# EAGLE schematic RFfrontend_v4 (EAGLE 7.5.0)

## Sheet 1 of 3
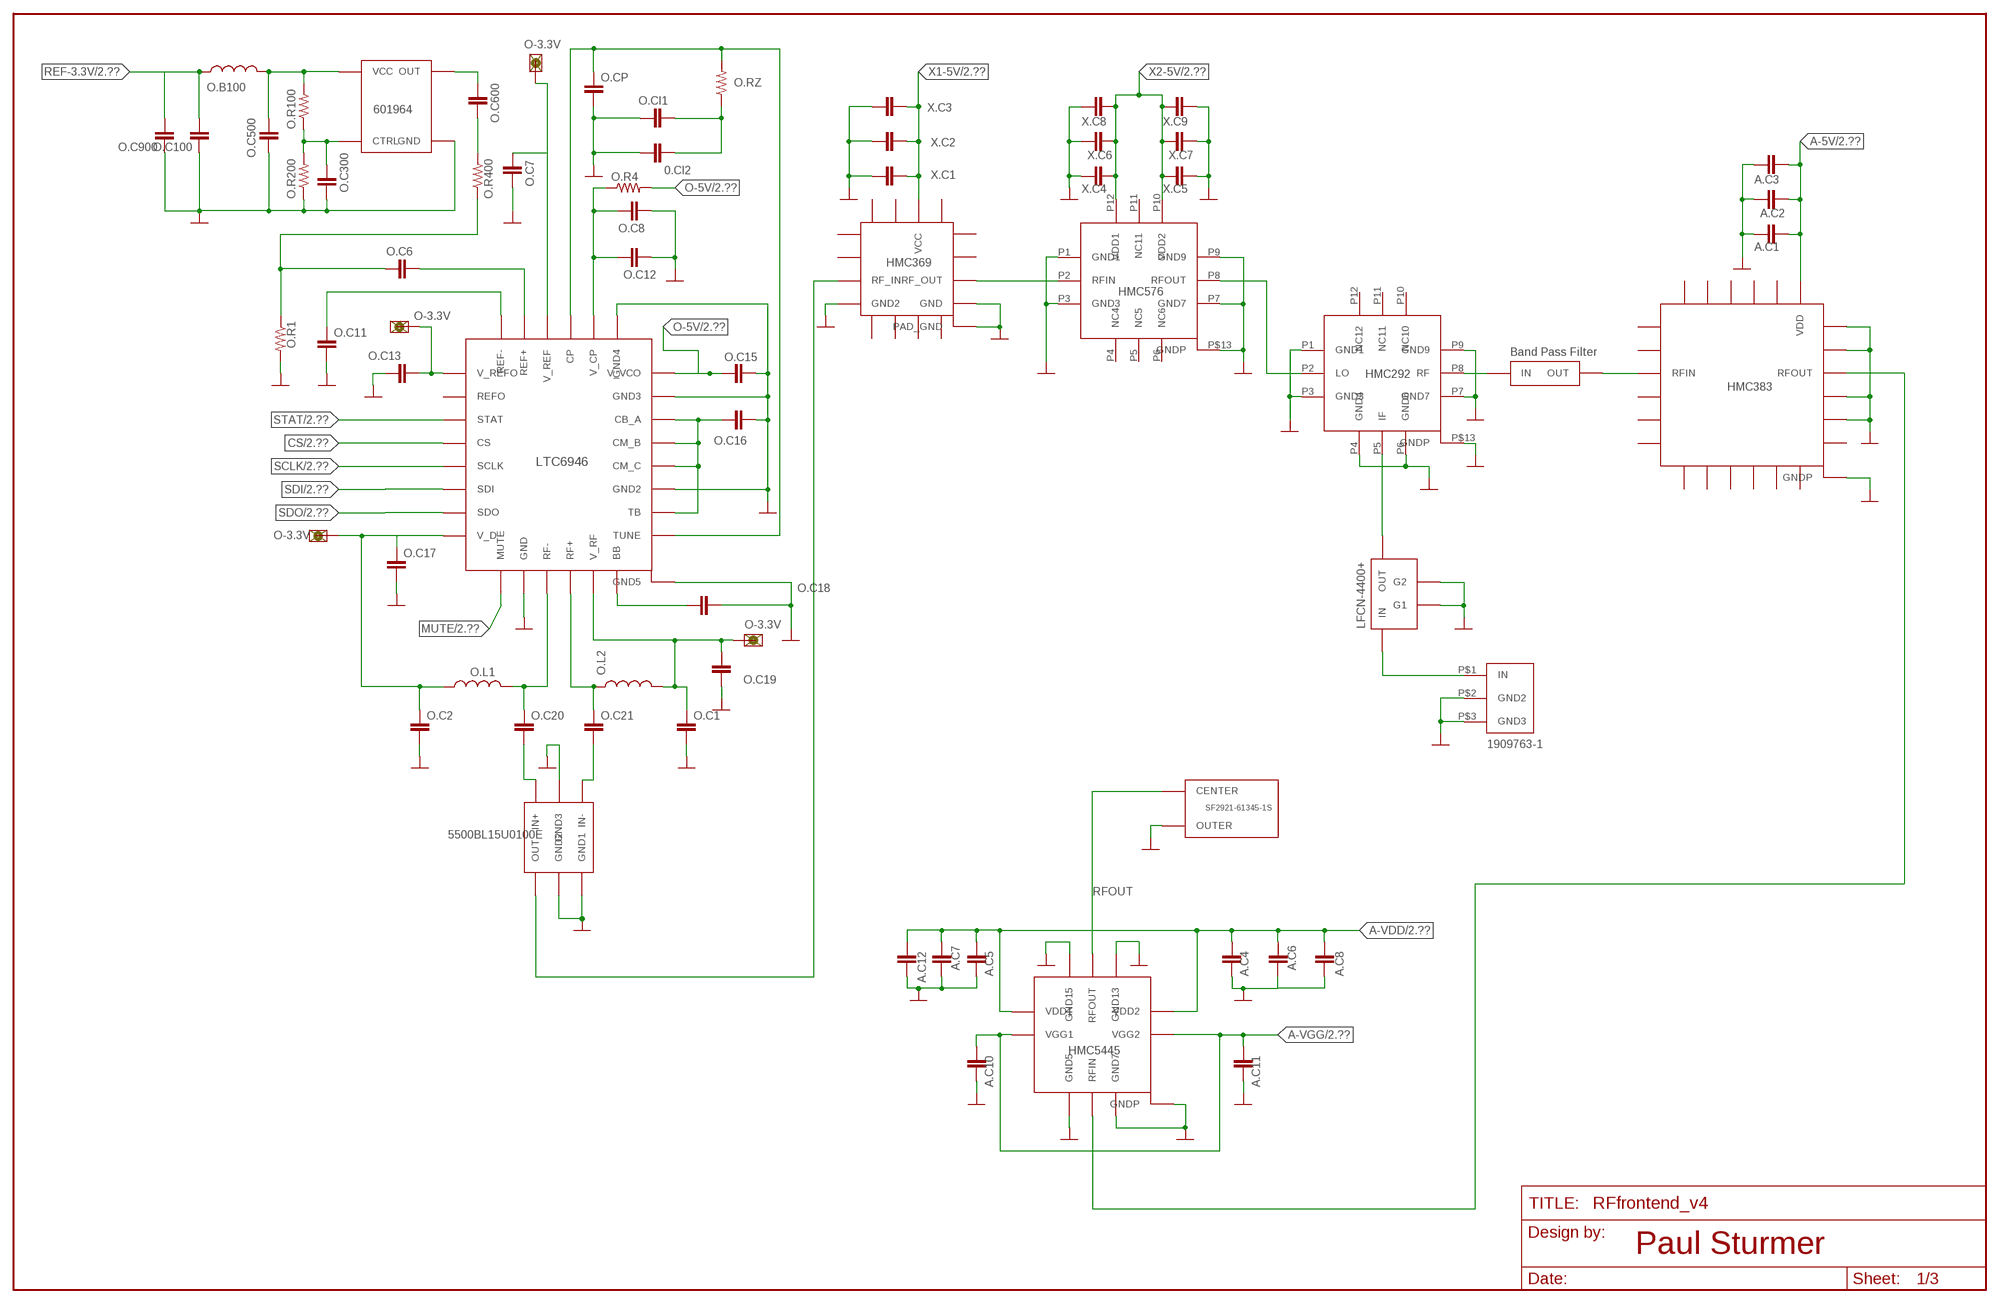
[diagram p0: schematic, sheet 1]

### Parts
0.CI2  CAP0805  [0805]
3.3V  1PIN_B-T-B_TOPPAD  [1PIN_B-T-B_TOPPAD]
A.C1  CAP0402-CAP  [0402-CAP]
A.C2  CAP0603-CAP  [0603-CAP]
A.C3  CAP0805  [0805]
A.C4  CAP0402-CAP  [0402-CAP]
A.C5  CAP0402-CAP  [0402-CAP]
A.C6  CAP0603-CAP  [0603-CAP]
A.C7  CAP0603-CAP  [0603-CAP]
A.C8  CAP0805  [0805]
A.C10  CAP0402-CAP  [0402-CAP]
A.C11  CAP0402-CAP  [0402-CAP]
A.C12  CAP0805  [0805]
O-3.3V  1PIN_B-T-B_TOPPAD  [1PIN_B-T-B_TOPPAD]
O.B100  INDUCTOR0603  [0603]
O.C1  CAP0402-CAP  [0402-CAP]
O.C2  CAP0402-CAP  [0402-CAP]
O.C6  CAP0402-CAP  [0402-CAP]
O.C7  CAP0402-CAP  [0402-CAP]
O.C8  CAP0805  [0805]
O.C11  CAP0402-CAP  [0402-CAP]
O.C12  CAP0402-CAP  [0402-CAP]
O.C13  CAP0402-CAP  [0402-CAP]
O.C15  CAP0402-CAP  [0402-CAP]
O.C16  CAP0805  [0805]
O.C17  CAP0402-CAP  [0402-CAP]
O.C18  CAP0805  [0805]
O.C19  CAP0402-CAP  [0402-CAP]
O.C20  CAP0402-CAP  [0402-CAP]
O.C21  CAP0402-CAP  [0402-CAP]
O.C100  CAP1206  [1206]
O.C300  CAP0603-CAP  [0603-CAP]
O.C500  CAP0603-CAP  [0603-CAP]
O.C600  CAP0603-CAP  [0603-CAP]
O.C900  CAP1206  [1206]
O.CI1  CAP0603-CAP  [0603-CAP]
O.CP  CAP0603-CAP  [0603-CAP]
O.L1  INDUCTOR0402  [C0402]
O.L2  INDUCTOR0402  [C0402]
O.R1  RESISTOR0402-RES  [0402-RES]
O.R4  RESISTOR0402-RES  [0402-RES]
O.R100  RESISTOR0603  [0603-RES]
O.R200  RESISTOR0603  [0603-RES]
O.R400  RESISTOR0603  [0603-RES]
O.RZ  RESISTOR0603  [0603-RES]
U$1  LINEAR_LTC6946  [QFN_28PIN]
U$9  1PIN_B-T-B_TOPPAD  [1PIN_B-T-B_TOPPAD]
U$13  CRYSTEK_601964  [4_PIN_9X14MM]
U$14  HITTITE_HMC369  [LP3]
U$15  MINICIRCUITS_LPF  [FV1206]
U$18  1PIN_B-T-B_TOPPAD  [1PIN_B-T-B_TOPPAD]
U$22  HITTITE_HMC576  [12PIN_QFN]
U$29  HITTITE_HMC292  [12PIN_QFN]
U$39  JOHNSON_5500BL15U0100  [6_PIN_BALUN]
U$41  BPF_24GHZ  [BPF_24GHZ]
U$43  HITTITE_HMC383  [24-QFN]
U$44  HITTITE_HMC5445  [16PIN_SMT]
U$75  SMA_STRAIGHT_SF2921-61345-1S  [SMA_STRAIGHT_SF2921-61345-1S]
U$169  TE_UMCC_CONNECTOR  [3_PIN_UMCC]
X.C1  CAP0402-CAP  [0402-CAP]
X.C2  CAP0603-CAP  [0603-CAP]
X.C3  CAP0805  [0805]
X.C4  CAP0402-CAP  [0402-CAP]
X.C5  CAP0402-CAP  [0402-CAP]
X.C6  CAP0603-CAP  [0603-CAP]
X.C7  CAP0603-CAP  [0603-CAP]
X.C8  CAP0805  [0805]
X.C9  CAP0805  [0805]

### Nets
12GHZ: U$14.PIN10(RF_OUT) U$22.P2(RFIN)
A-5V: A.C1.2 A.C2.2 A.C3.2 U$43.P$19(VDD) ; also sheet 2
A-VDD: A.C4.2 A.C5.2 A.C6.2 A.C7.2 A.C8.2 A.C12.2 U$44.P1(VDD1) U$44.P11(VDD2) ; also sheet 2
A-VGG: A.C10.2 A.C11.2 U$44.P2(VGG1) U$44.P10(VGG2) ; also sheet 2
AGND: 0.CI2.1 A.C1.1 A.C2.1 A.C3.1 A.C4.1 A.C5.1 A.C6.1 A.C7.1 A.C8.1 A.C10.1 A.C11.1 A.C12.1 O.C1.2 O.C2.2 O.C7.1 O.C8.2 O.C11.2 O.C12.2 O.C13.1 O.C15.2 O.C16.2 O.C17.2 O.C18.2 O.C19.1 O.C100.1 O.C300.2 O.C500.2 O.C900.1 O.CI1.1 O.CP.2 O.R1.2 O.R200.1 U$1.P$10(GND) U$1.P$17(GND2) U$1.P$21(GND3) U$1.P$23(GND4) U$1.P$29(GND5) U$13.GND U$14.PAD_GND U$14.PIN4(GND2) U$14.PIN9(GND) U$15.P$1(G1) U$15.P$2(G2) U$22.P1(GND1) U$22.P3(GND3) U$22.P7(GND7) U$22.P9(GND9) U$22.P$13(GNDP) U$29.P1(GND1) U$29.P3(GND3) U$29.P4(GND4) U$29.P6(GND6) U$29.P7(GND7) U$29.P9(GND9) U$29.P$13(GNDP) U$39.P$2(GND2) U$39.P$3(GND1) U$39.P$5(GND3) U$43.P$14(NC14) U$43.P$15(NC15) U$43.P$17(NC17) U$43.P$18(NC18) U$43.P$25(GNDP) U$44.GNDP U$44.P5(GND5) U$44.P7(GND7) U$44.P13(GND13) U$44.P15(GND15) U$75.OUTER U$169.P$2(GND2) U$169.P$3(GND3) X.C1.1 X.C2.1 X.C3.1 X.C4.1 X.C5.2 X.C6.1 X.C7.2 X.C8.1 X.C9.2 ; also sheet 2
CS: U$1.P$4(CS) ; also sheet 2
MUTE: U$1.P$9(MUTE) ; also sheet 2
N$1: O.C8.1 O.C12.1 O.R4.1 U$1.P$24(V_CP)
N$2: O.C16.1 U$1.P$16(TB) U$1.P$18(CM_C) U$1.P$19(CM_B) U$1.P$20(CB_A)
N$3: O.C20.2 U$39.P$6(IN+)
N$4: 0.CI2.2 O.CI1.2 O.RZ.1
N$5: O.CP.1 O.RZ.2 U$1.P$15(TUNE) U$1.P$25(CP)
N$6: O.C18.1 U$1.P$14(BB)
N$7: O.C20.1 O.L1.2 U$1.P$11(RF-)
N$8: O.C21.1 O.L2.1 U$1.P$12(RF+)
N$9: O.C21.2 U$39.P$4(IN-)
N$10: U$14.PIN3(RF_IN) U$39.P$1(OUT)
N$11: O.C11.1 U$1.P$28(REF-)
N$12: O.C6.2 U$1.P$27(REF+)
N$13: O.C6.1 O.R1.1 O.R400.1
N$14: O.B100.2 O.C500.1 O.R100.2 U$13.VCC
N$15: O.C300.1 O.R100.1 O.R200.2 U$13.VCTRL(CTRL)
N$16: O.C600.1 U$13.OUT
N$17: U$22.P8(RFOUT) U$29.P2(LO)
N$18: O.C600.2 O.R400.2
N$20: U$15.P$4(OUT) U$29.P5(IF)
N$26: U$29.P8(RF) U$41.IN
N$27: U$41.OUT U$43.P$3(RFIN)
N$28: U$43.P$16(RFOUT) U$44.P6(RFIN)
N$32: U$15.P$3(IN) U$169.P$1(IN)
O-3.3V: 3.3V.P$1 O-3.3V.P$1 O.C1.1 O.C2.1 O.C7.2 O.C13.2 O.C17.1 O.C19.2 O.L1.1 O.L2.2 U$1.P$1(V_REFO) U$1.P$8(V_D) U$1.P$13(V_RF) U$1.P$26(V_REF) U$9.P$1 U$18.P$1 ; also sheet 2
O-5V: O.C15.1 O.R4.2 U$1.P$22(V_VCO) ; also sheet 2
REF-3.3V: O.B100.1 O.C100.2 O.C900.2 ; also sheet 2
RFOUT: U$44.P14(RFOUT) U$75.CENTER
SCLK: U$1.P$5(SCLK) ; also sheet 2
SDI: U$1.P$6(SDI) ; also sheet 2
SDO: U$1.P$7(SDO) ; also sheet 2
STAT: U$1.P$3(STAT) ; also sheet 2
X1-5V: U$14.PIN14(VCC) X.C1.2 X.C2.2 X.C3.2 ; also sheet 2
X2-5V: U$22.P10(VDD2) U$22.P12(VDD1) X.C4.2 X.C5.1 X.C6.2 X.C7.1 X.C8.2 X.C9.1 ; also sheet 2
Unconnected: U$1.P$2(REFO) U$14.PIN1 U$14.PIN2 U$14.PIN5 U$14.PIN6 U$14.PIN7 U$14.PIN8 U$14.PIN11 U$14.PIN12 U$14.PIN13 U$14.PIN15 U$14.PIN16 U$22.P4(NC4) U$22.P5(NC5) U$22.P6(NC6) U$22.P11(NC11) U$29.P10(NC10) U$29.P11(NC11) U$29.P12(NC12) U$43.P$1(NC1) U$43.P$2(NC2) U$43.P$4(NC4) U$43.P$5(NC5) U$43.P$6(NC6) U$43.P$7(NC7) U$43.P$8(NC8) U$43.P$9(NC9) U$43.P$10(NC10) U$43.P$11(NC11) U$43.P$12(NC12) U$43.P$13(NC13) U$43.P$20(NC20) U$43.P$21(NC21) U$43.P$22(NC22) U$43.P$23(NC23) U$43.P$24(NC24)

## Sheet 2 of 3
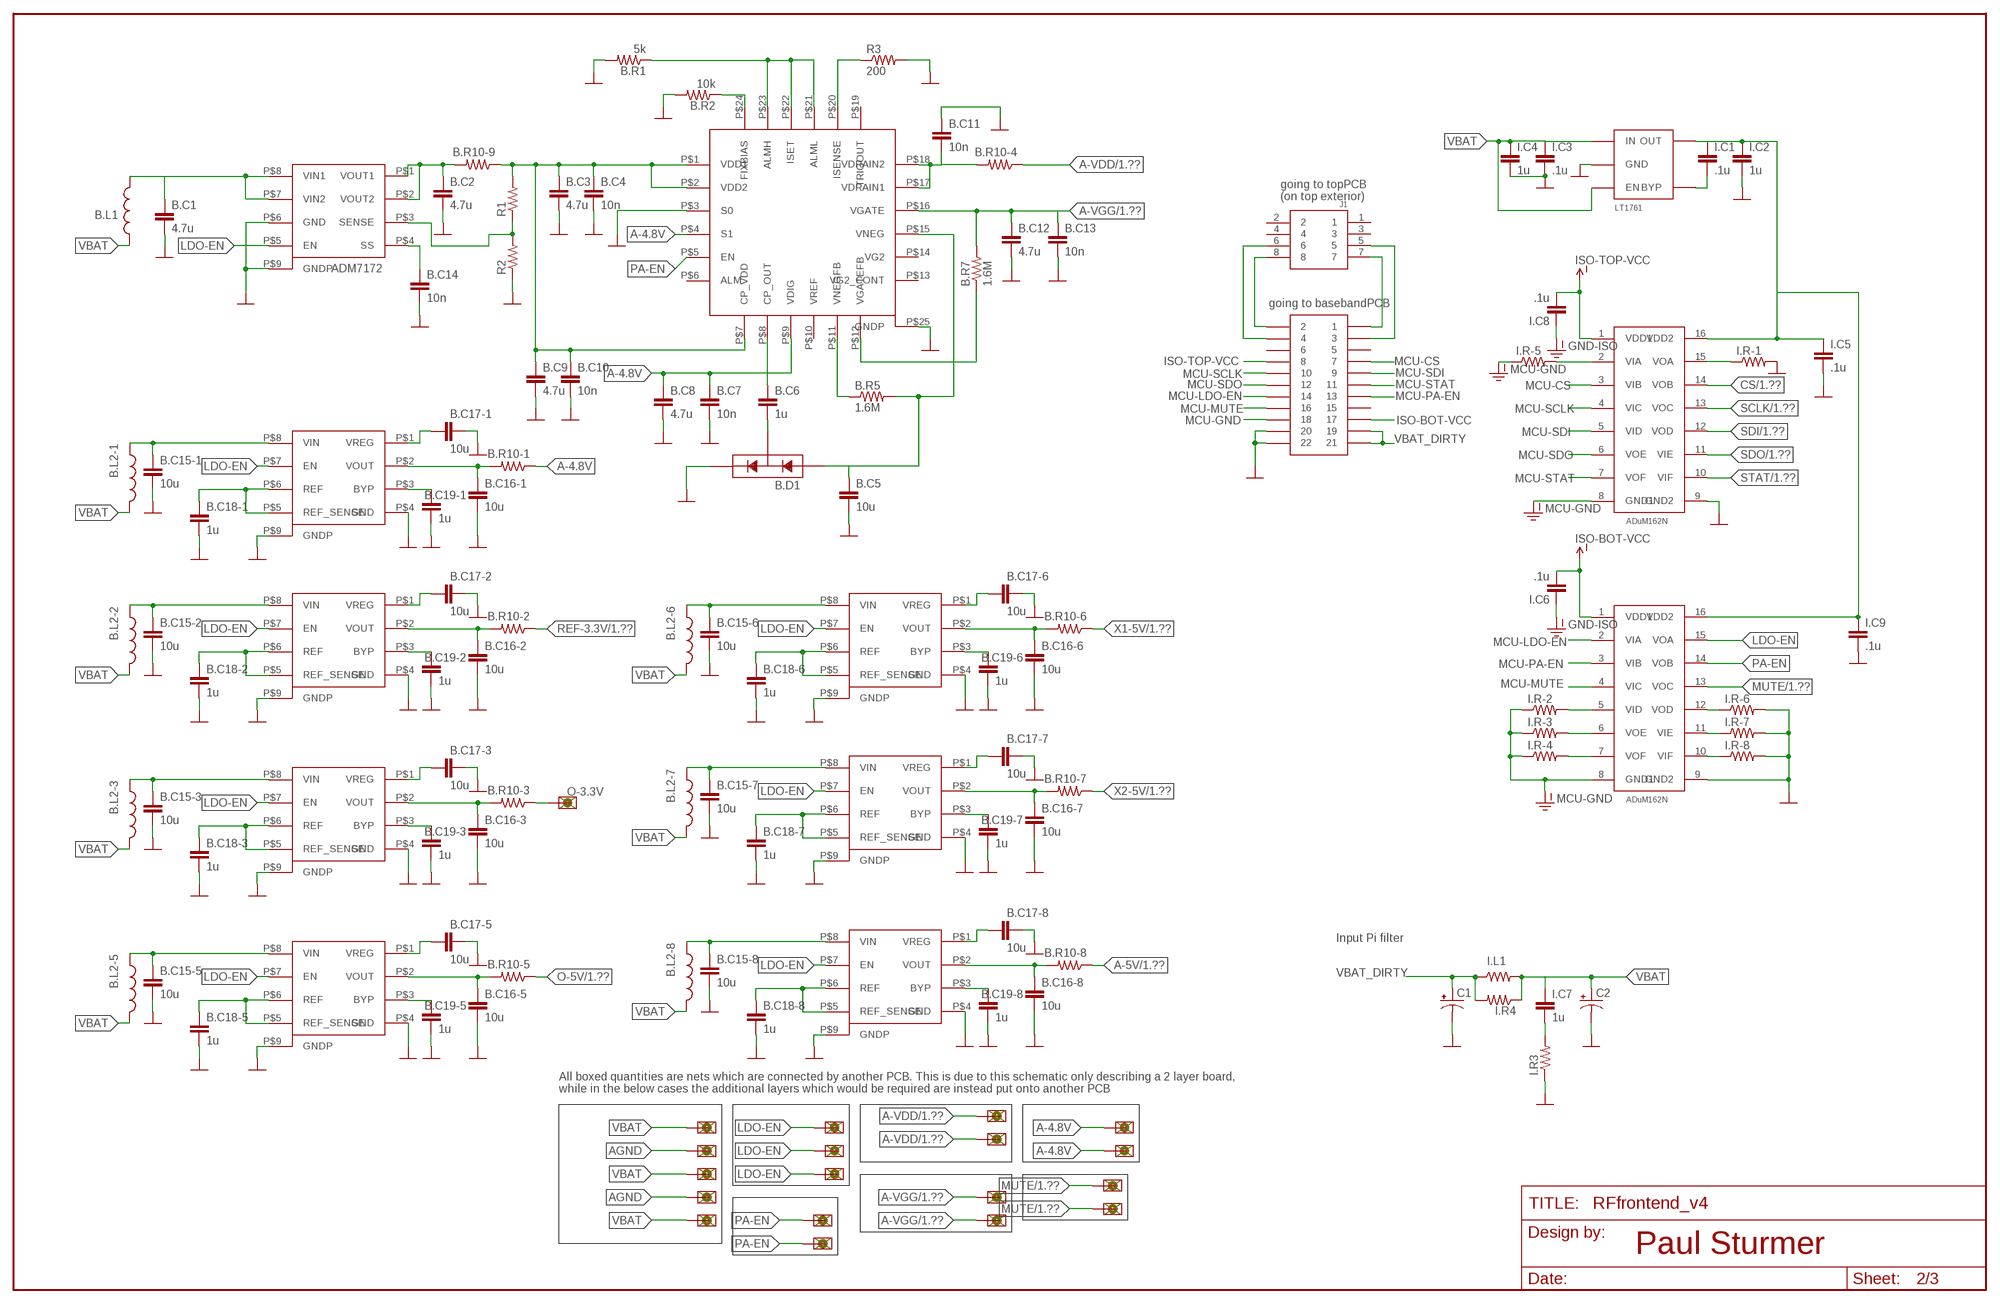
[diagram p1: schematic, sheet 2]

### Parts
B.C1  4.7u  CAP1206  [1206]
B.C2  4.7u  CAP1206  [1206]
B.C3  4.7u  CAP0603-CAP  [0603-CAP]
B.C4  10n  CAP0603-CAP  [0603-CAP]
B.C5  10u  CAP0805  [0805]
B.C6  1u  CAP0805  [0805]
B.C7  10n  CAP0603-CAP  [0603-CAP]
B.C8  4.7u  CAP0603-CAP  [0603-CAP]
B.C9  4.7u  CAP0603-CAP  [0603-CAP]
B.C10  10n  CAP0603-CAP  [0603-CAP]
B.C11  10n  CAP0603-CAP  [0603-CAP]
B.C12  4.7u  CAP0603-CAP  [0603-CAP]
B.C13  10n  CAP0603-CAP  [0603-CAP]
B.C14  10n  CAP0603-CAP  [0603-CAP]
B.C15-1  10u  CAP0805  [0805]
B.C15-2  10u  CAP0805  [0805]
B.C15-3  10u  CAP0805  [0805]
B.C15-5  10u  CAP0805  [0805]
B.C15-6  10u  CAP0805  [0805]
B.C15-7  10u  CAP0805  [0805]
B.C15-8  10u  CAP0805  [0805]
B.C16-1  10u  CAP0805  [0805]
B.C16-2  10u  CAP0805  [0805]
B.C16-3  10u  CAP0805  [0805]
B.C16-5  10u  CAP0805  [0805]
B.C16-6  10u  CAP0805  [0805]
B.C16-7  10u  CAP0805  [0805]
B.C16-8  10u  CAP0805  [0805]
B.C17-1  10u  CAP0805  [0805]
B.C17-2  10u  CAP0805  [0805]
B.C17-3  10u  CAP0805  [0805]
B.C17-5  10u  CAP0805  [0805]
B.C17-6  10u  CAP0805  [0805]
B.C17-7  10u  CAP0805  [0805]
B.C17-8  10u  CAP0805  [0805]
B.C18-1  1u  CAP0805  [0805]
B.C18-2  1u  CAP0805  [0805]
B.C18-3  1u  CAP0805  [0805]
B.C18-5  1u  CAP0805  [0805]
B.C18-6  1u  CAP0805  [0805]
B.C18-7  1u  CAP0805  [0805]
B.C18-8  1u  CAP0805  [0805]
B.C19-1  1u  CAP0805  [0805]
B.C19-2  1u  CAP0805  [0805]
B.C19-3  1u  CAP0805  [0805]
B.C19-5  1u  CAP0805  [0805]
B.C19-6  1u  CAP0805  [0805]
B.C19-7  1u  CAP0805  [0805]
B.C19-8  1u  CAP0805  [0805]
B.D1  ONSEMI_DIODE_BAT54SL  [SOT23-3]
B.L1  INDUCTOR0805  [0805]
B.L2-1  INDUCTOR0603  [0603]
B.L2-2  INDUCTOR0603  [0603]
B.L2-3  INDUCTOR0603  [0603]
B.L2-5  INDUCTOR0603  [0603]
B.L2-6  INDUCTOR0603  [0603]
B.L2-7  INDUCTOR0603  [0603]
B.L2-8  INDUCTOR0603  [0603]
B.R1  5k  RESISTOR0603  [0603-RES]
B.R2  10k  RESISTOR0805-RES  [0805]
B.R5  1.6M  RESISTOR0805-RES  [0805]
B.R7  1.6M  RESISTOR0805-RES  [0805]
B.R10-1  RESISTOR0805-RES  [0805]
B.R10-2  RESISTOR0805-RES  [0805]
B.R10-3  RESISTOR0805-RES  [0805]
B.R10-4  RESISTOR0805-RES  [0805]
B.R10-5  RESISTOR0805-RES  [0805]
B.R10-6  RESISTOR0805-RES  [0805]
B.R10-7  RESISTOR0805-RES  [0805]
B.R10-8  RESISTOR0805-RES  [0805]
B.R10-9  RESISTOR0805-RES  [0805]
C1  CAP_POL7343  [EIA7343]
C2  CAP_POL7343  [EIA7343]
I.C1  .1u  CAP0402-CAP  [0402-CAP]
I.C2  1u  CAP0805  [0805]
I.C3  .1u  CAP0402-CAP  [0402-CAP]
I.C4  1u  CAP0805  [0805]
I.C5  .1u  CAP0402-CAP  [0402-CAP]
I.C6  .1u  CAP0402-CAP  [0402-CAP]
I.C7  1u  CAP0805  [0805]
I.C8  .1u  CAP0402-CAP  [0402-CAP]
I.C9  .1u  CAP0402-CAP  [0402-CAP]
I.L1  RESISTOR1206  [1206]
I.R3  RESISTOR0805-RES  [0805]
I.R4  RESISTOR0805-RES  [0805]
I.R-1  RESISTOR0402-RES  [0402-RES]
I.R-2  RESISTOR0402-RES  [0402-RES]
I.R-3  RESISTOR0402-RES  [0402-RES]
I.R-4  RESISTOR0402-RES  [0402-RES]
I.R-5  RESISTOR0402-RES  [0402-RES]
I.R-6  RESISTOR0402-RES  [0402-RES]
I.R-7  RESISTOR0402-RES  [0402-RES]
I.R-8  RESISTOR0402-RES  [0402-RES]
J1  SLW-104-01-X-D  [SLW-104-01-X-D]
R1  RESISTOR0805-RES  [0805]
R2  RESISTOR0805-RES  [0805]
R3  200  RESISTOR0805-RES  [0805]
U$19  1PIN_B-T-B_TOPPAD  [1PIN_B-T-B_TOPPAD]
U$20  1PIN_B-T-B_TOPPAD  [1PIN_B-T-B_TOPPAD]
U$25  1PIN_B-T-B_TOPPAD  [1PIN_B-T-B_TOPPAD]
U$26  1PIN_B-T-B_TOPPAD  [1PIN_B-T-B_TOPPAD]
U$28  1PIN_B-T-B_TOPPAD  [1PIN_B-T-B_TOPPAD]
U$35  1PIN_B-T-B_TOPPAD  [1PIN_B-T-B_TOPPAD]
U$36  1PIN_B-T-B_TOPPAD  [1PIN_B-T-B_TOPPAD]
U$51  ANALOG_ADUM162N0BRZ  [SO16]
U$61  ANALOG_LDO_ADM7172  [8-LFCSP]
U$62  HITTITE_HMC980LP4E  [24-QFN]
U$84  ANALOG_LDO_ADM7150  [8-LFCSP]
U$95  ANALOG_LDO_ADM7150  [8-LFCSP]
U$103  ANALOG_LDO_ADM7150  [8-LFCSP]
U$111  ANALOG_ADUM162N0BRZ  [SO16]
U$113  LINEAR_LDO_LT1761-X  [SOT-23-5]
U$119  ANALOG_LDO_ADM7150  [8-LFCSP]
U$127  ANALOG_LDO_ADM7150  [8-LFCSP]
U$135  ANALOG_LDO_ADM7150  [8-LFCSP]
U$143  ANALOG_LDO_ADM7150  [8-LFCSP]
U$152  1PIN_B-T-B_GROUND  [1PIN_B-T-B_GROUND]
U$153  1PIN_B-T-B_TOPPAD  [1PIN_B-T-B_TOPPAD]
U$154  1PIN_B-T-B_TOPPAD  [1PIN_B-T-B_TOPPAD]
U$155  1PIN_B-T-B_TOPPAD  [1PIN_B-T-B_TOPPAD]
U$156  1PIN_B-T-B_GROUND  [1PIN_B-T-B_GROUND]
U$157  1PIN_B-T-B_TOPPAD  [1PIN_B-T-B_TOPPAD]
U$174  1PIN_B-T-B_TOPPAD  [1PIN_B-T-B_TOPPAD]
U$175  1PIN_B-T-B_TOPPAD  [1PIN_B-T-B_TOPPAD]
U$176  1PIN_B-T-B_TOPPAD  [1PIN_B-T-B_TOPPAD]
U$177  1PIN_B-T-B_TOPPAD  [1PIN_B-T-B_TOPPAD]
U$180  SSW-111-XX-XXX-D  [SSW-111-XX-XXX-D]
U$189  1PIN_B-T-B_TOPPAD  [1PIN_B-T-B_TOPPAD]
U$190  1PIN_B-T-B_TOPPAD  [1PIN_B-T-B_TOPPAD]

### Nets
6.3V: B.C3.1 B.C4.1 B.C9.1 B.C10.1 B.R10-9.1 R1.2 U$62.P$1(VDD1) U$62.P$2(VDD2) U$62.P$7(CP_VDD)
A-4.8V: B.C7.1 B.C8.1 B.C16-1.1 B.R10-1.1 B.R10-1.2 U$26.P$1 U$28.P$1 U$62.P$4(S1) U$62.P$9(VDIG) U$84.P$2(VOUT)
A-5V: B.R10-8.1 ; also sheet 1
A-VDD: B.C11.2 B.R10-4.1 B.R10-4.2 U$62.P$17(VDRAIN1) U$62.P$18(VDRAIN2) U$174.P$1 U$175.P$1 ; also sheet 1
A-VGG: B.C12.1 B.C13.1 B.R7.2 U$62.P$16(VGATE) U$176.P$1 U$177.P$1 ; also sheet 1
AGND: B.C1.2 B.C2.2 B.C3.2 B.C4.2 B.C5.2 B.C7.2 B.C8.2 B.C9.2 B.C10.2 B.C11.1 B.C12.2 B.C13.2 B.C14.2 B.C15-1.2 B.C15-2.2 B.C15-3.2 B.C15-5.2 B.C15-6.2 B.C15-7.2 B.C15-8.2 B.C16-1.2 B.C16-2.2 B.C16-3.2 B.C16-5.2 B.C16-6.2 B.C16-7.2 B.C16-8.2 B.C17-1.1 B.C17-2.1 B.C17-3.1 B.C17-5.1 B.C17-6.1 B.C17-7.1 B.C17-8.1 B.C18-1.2 B.C18-2.2 B.C18-3.2 B.C18-5.2 B.C18-6.2 B.C18-7.2 B.C18-8.2 B.C19-1.2 B.C19-2.2 B.C19-3.2 B.C19-5.2 B.C19-6.2 B.C19-7.2 B.C19-8.2 B.D1.2 B.R1.2 B.R2.2 C1.C(-) C2.C(-) I.C2.2 I.C3.2 I.C4.2 I.C5.2 I.C9.2 I.R3.1 I.R-1.2 I.R-6.2 I.R-7.2 I.R-8.2 R2.1 R3.2 U$51.9(GND2) U$61.P$6(GND) U$61.P$9(GNDP) U$62.P$3(S0) U$62.P$25(GNDP) U$84.P$4(GND) U$84.P$9(GNDP) U$95.P$4(GND) U$95.P$9(GNDP) U$103.P$4(GND) U$103.P$9(GNDP) U$111.9(GND2) U$113.P$2(GND) U$119.P$4(GND) U$119.P$9(GNDP) U$127.P$4(GND) U$127.P$9(GNDP) U$135.P$4(GND) U$135.P$9(GNDP) U$143.P$4(GND) U$143.P$9(GNDP) U$152.P$2 U$156.P$2 U$180.20 U$180.22 ; also sheet 1
CS: U$111.14(VOB) ; also sheet 1
ISO-3.3V: I.C1.1 I.C2.1 I.C5.1 I.C9.1 U$51.16(VDD2) U$111.16(VDD2) U$113.P$5(OUT)
ISO-BOT-VCC: I.C6.2 U$51.1(VDD1) U$180.17
ISO-TOP-VCC: I.C8.2 U$111.1(VDD1) U$180.8
LDO-EN: U$35.P$1 U$36.P$1 U$51.15(VOA) U$61.P$5(EN) U$84.P$7(EN) U$95.P$7(EN) U$103.P$7(EN) U$119.P$7(EN) U$127.P$7(EN) U$135.P$7(EN) U$143.P$7(EN) U$153.P$1
MCU-CS: U$111.3(VIB) U$180.7
MCU-GND: I.C6.1 I.C8.1 I.R-2.1 I.R-3.1 I.R-4.1 I.R-5.1 U$51.8(GND1) U$111.8(GND1) U$180.18 ; supply symbol labelled GND-ISO
MCU-LDO-EN: U$51.2(VIA) U$180.14
MCU-MUTE: U$51.4(VIC) U$180.16
MCU-PA-EN: U$51.3(VIB) U$180.13
MCU-SCLK: U$111.4(VIC) U$180.10
MCU-SDI: U$111.5(VID) U$180.9
MCU-SDO: U$111.6(VOE) U$180.12
MCU-STAT: U$111.7(VOF) U$180.11
MUTE: U$51.13(VOC) U$189.P$1 U$190.P$1 ; also sheet 1
N$29: R1.1 R2.2 U$61.P$3(SENSE)
N$30: I.R-1.1 U$111.15(VOA)
N$35: R3.1 U$62.P$20(ISENSE)
N$36: B.R7.1 U$62.P$12(VGATEFB)
N$37: B.C5.1 B.D1.1 B.R5.2 U$62.P$15(VNEG)
N$39: B.R5.1 U$62.P$11(VNEGFB)
N$42: B.C6.1 U$62.P$8(CP_OUT)
N$43: B.C6.2 B.D1.3
N$44: B.R1.1 U$62.P$21(ALML) U$62.P$22(ISET) U$62.P$23(ALMH)
N$45: B.R2.1 U$62.P$24(FIXBIAS)
N$46: B.C14.1 U$61.P$4(SS)
N$47: B.C15-1.1 B.L2-1.1 U$84.P$8(VIN)
N$48: B.C17-1.2 U$84.P$1(VREG)
N$49: B.C18-1.1 U$84.P$5(REF_SENSE) U$84.P$6(REF)
N$50: B.C15-2.1 B.L2-2.1 U$95.P$8(VIN)
N$51: J1.7 U$180.1
N$52: B.C19-1.1 U$84.P$3(BYP)
N$53: B.C18-2.1 U$95.P$5(REF_SENSE) U$95.P$6(REF)
N$54: B.C19-2.1 U$95.P$3(BYP)
N$55: B.C16-2.1 B.R10-2.2 U$95.P$2(VOUT)
N$56: B.C15-5.1 B.L2-5.1 U$119.P$8(VIN)
N$57: B.C15-3.1 B.L2-3.1 U$103.P$8(VIN)
N$58: B.C17-3.2 U$103.P$1(VREG)
N$59: B.C18-3.1 U$103.P$5(REF_SENSE) U$103.P$6(REF)
N$60: B.C19-3.1 U$103.P$3(BYP)
N$61: B.C16-3.1 B.R10-3.2 U$103.P$2(VOUT)
N$62: B.C17-5.2 U$119.P$1(VREG)
N$63: I.C1.2 U$113.P$4(BYP)
N$64: J1.5 U$180.3
N$66: B.C17-2.2 U$95.P$1(VREG)
N$69: B.C18-5.1 U$119.P$5(REF_SENSE) U$119.P$6(REF)
N$70: B.C19-5.1 U$119.P$3(BYP)
N$71: B.C16-5.1 B.R10-5.2 U$119.P$2(VOUT)
N$72: B.C15-6.1 B.L2-6.1 U$127.P$8(VIN)
N$73: B.C17-6.2 U$127.P$1(VREG)
N$74: B.C18-6.1 U$127.P$5(REF_SENSE) U$127.P$6(REF)
N$75: I.R-5.2 U$111.2(VIA)
N$76: B.C16-6.1 B.R10-6.2 U$127.P$2(VOUT)
N$77: B.C15-7.1 B.L2-7.1 U$135.P$8(VIN)
N$78: B.C17-7.2 U$135.P$1(VREG)
N$79: B.C18-7.1 U$135.P$5(REF_SENSE) U$135.P$6(REF)
N$80: B.C19-7.1 U$135.P$3(BYP)
N$81: B.C16-7.1 B.R10-7.2 U$135.P$2(VOUT)
N$82: B.C15-8.1 B.L2-8.1 U$143.P$8(VIN)
N$83: B.C17-8.2 U$143.P$1(VREG)
N$84: B.C18-8.1 U$143.P$5(REF_SENSE) U$143.P$6(REF)
N$85: B.C19-8.1 U$143.P$3(BYP)
N$86: B.C16-8.1 B.R10-8.2 U$143.P$2(VOUT)
N$95: B.C2.1 B.R10-9.2 U$61.P$1(VOUT1) U$61.P$2(VOUT2)
N$116: I.C7.2 I.R3.2
N$117: J1.8 U$180.2
N$124: J1.6 U$180.4
N$136: I.R-2.2 U$51.5(VID)
N$138: I.R-4.2 U$51.7(VOF)
N$139: I.R-3.2 U$51.6(VOE)
N$148: I.R-6.1 U$51.12(VOD)
N$160: I.R-7.1 U$51.11(VIE)
N$162: I.R-8.1 U$51.10(VIF)
N$700: B.C19-6.1 U$127.P$3(BYP)
O-3.3V: B.R10-3.1 U$19.P$1 ; also sheet 1
O-5V: B.R10-5.1 ; also sheet 1
PA-EN: U$51.14(VOB) U$62.P$5(EN) U$154.P$1 U$157.P$1
REF-3.3V: B.R10-2.1 ; also sheet 1
SCLK: U$111.13(VOC) ; also sheet 1
SDI: U$111.12(VOD) ; also sheet 1
SDO: U$111.11(VIE) ; also sheet 1
STAT: U$111.10(VIF) ; also sheet 1
VBAT: B.L1.1 B.L2-1.2 B.L2-2.2 B.L2-3.2 B.L2-5.2 B.L2-6.2 B.L2-7.2 B.L2-8.2 C2.A(+) I.C3.1 I.C4.1 I.C7.1 I.L1.2 I.R4.1 U$20.P$1 U$25.P$1 U$113.P$1(IN) U$113.P$3(EN) U$155.P$1
VBAT_DIRTY: C1.A(+) I.L1.1 I.R4.2 U$180.19 U$180.21
VIN: B.C1.1 B.L1.2 U$61.P$7(VIN2) U$61.P$8(VIN1)
X1-5V: B.R10-6.1 ; also sheet 1
X2-5V: B.R10-7.1 ; also sheet 1
Unconnected: J1.1 J1.2 J1.3 J1.4 U$62.P$6(ALM) U$62.P$10(VREF) U$62.P$13(VG2_CONT) U$62.P$14(VG2) U$62.P$19(TRIGOUT) U$180.5 U$180.6 U$180.15

### Notes on the sheet
- going to topPCB 
  (on top exterior)
- going to basebandPCB
- Input Pi filter
- All boxed quantities are nets which are connected by another PCB. This is due to this schematic only describing a 2 layer board, 
  while in the below cases the additional layers which would be required are instead put onto another PCB

## Sheet 3 of 3

## Library data of the parts
0.CI2 A.C1-A.C8 A.C10-A.C12 B.C1-B.C14 B.C15-1-B.C15-3 B.C15-5-B.C15-8 B.C16-1-B.C16-3 B.C16-5-B.C16-8 B.C17-1-B.C17-3 B.C17-5-B.C17-8 B.C18-1-B.C18-3 B.C18-5-B.C18-8 B.C19-1-B.C19-3 B.C19-5-B.C19-8 I.C1-I.C9 O.C1 O.C2 O.C6-O.C8 O.C11-O.C13 O.C15-O.C21 O.C100 O.C300 O.C500 O.C600 O.C900 O.CI1 O.CP X.C1-X.C9 = SparkFun-Capacitors:CAP: Capacitor Standard 0603 ceramic capacitor, and 0.1" leaded capacitor.
3.3V O-3.3V U$9 U$18-U$20 U$25 U$26 U$28 U$35 U$36 U$153-U$155 U$157 U$174-U$177 U$189 U$190 = I_O_connectors:1PIN_B-T-B_TOPPAD
B.D1 = ICs:ONSEMI_DIODE_BAT54SL
B.L1 B.L2-1-B.L2-3 B.L2-5-B.L2-8 O.B100 O.L1 O.L2 = SparkFun-Passives:INDUCTOR: Inductors Basic Inductor/Choke - 0603 and 1206. Footprints are not proven and vary greatly between part numbers. SRN6045- 33uH, 20% 1.4A SDR0403-560KL - 56uH, 10%, 500mA RMS/740mA peak
B.R1 B.R2 B.R5 B.R7 B.R10-1-B.R10-9 I.L1 I.R3 I.R4 I.R-1-I.R-8 O.R1 O.R4 O.R100 O.R200 O.R400 O.RZ R1-R3 = SparkFun-Resistors:RESISTOR: Resistor Basic schematic elements and footprints for 0603, 1206, and PTH resistors.
C1 C2 = SparkFun-Capacitors:CAP_POL: Capacitor Polarized These are standard SMD and PTH capacitors. Normally 10uF, 47uF, and 100uF in electrolytic and tantalum varieties. Always verify the external diameter of the through hole cap, it varies with capacity, voltage, and manufacturer. The EIA devices should be standard.
J1 = I_O_connectors:SLW-104-01-X-D: Low Profile Contact Socket Strip, Double Row Through Hole.
U$1 = mmComponents:LINEAR_LTC6946
U$13 = mmComponents:CRYSTEK_601964
U$14 = mmComponents:HITTITE_HMC369
U$15 = mmComponents:MINICIRCUITS_LPF
U$22 = mmComponents:HITTITE_HMC576
U$29 = mmComponents:HITTITE_HMC292
U$39 = mmComponents:JOHNSON_5500BL15U0100
U$41 = mmComponents:BPF_24GHZ
U$43 = mmComponents:HITTITE_HMC383
U$44 = mmComponents:HITTITE_HMC5445
U$51 U$111 = ICs:ANALOG_ADUM162N0BRZ
U$61 = ICs:ANALOG_LDO_ADM7172
U$62 = mmComponents:HITTITE_HMC980LP4E
U$75 = mmComponents:SMA_STRAIGHT_SF2921-61345-1S
U$84 U$95 U$103 U$119 U$127 U$135 U$143 = mmComponents:ANALOG_LDO_ADM7150
U$113 = ICs:LINEAR_LDO_LT1761-X
U$152 U$156 = I_O_connectors:1PIN_B-T-B_GROUND
U$169 = mmComponents:TE_UMCC_CONNECTOR
U$180 = I_O_connectors:SSW-111-XX-XXX-D